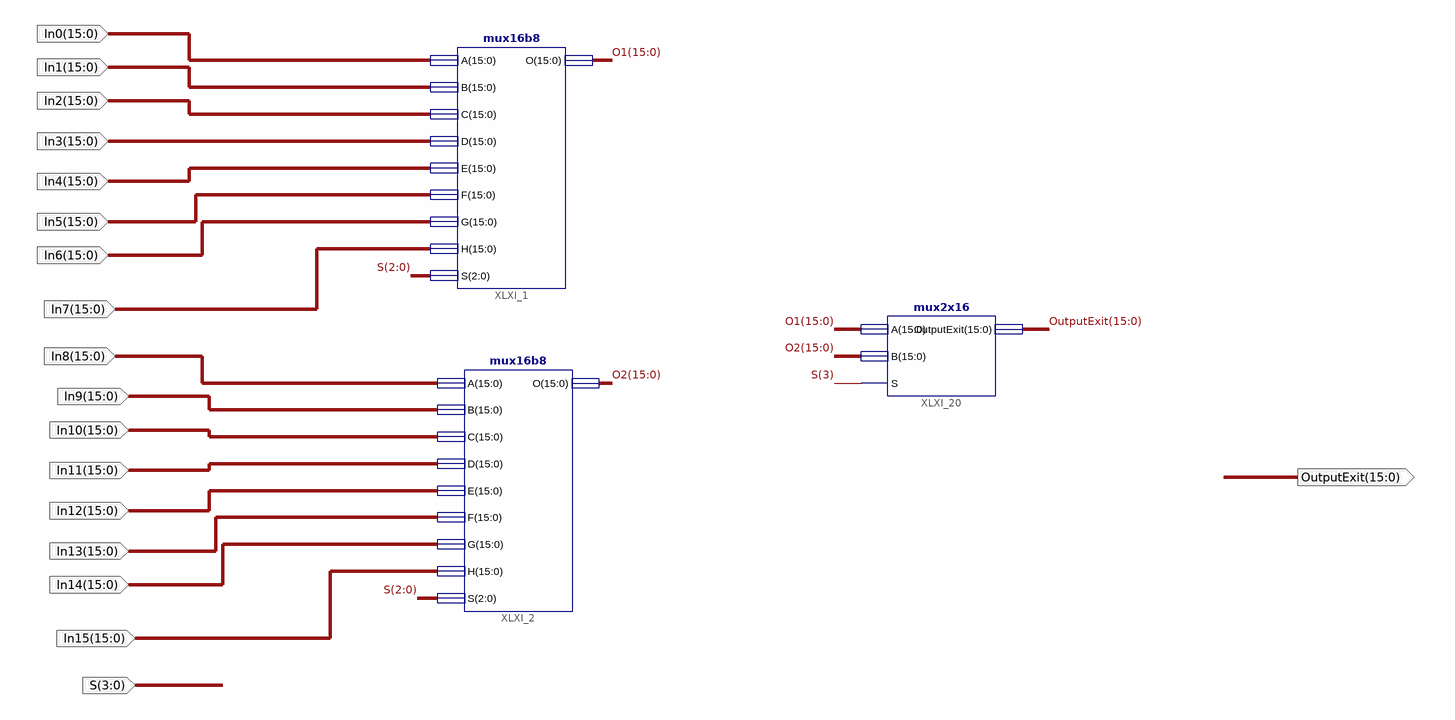
[diagram p0: schematic sheet 1]
// Xilinx ISE schematic Mux16x16.sch (spartan3e) as structural Verilog: 3 symbols, 18 ports
module Mux16x16 (
  input  [15:0] In1,
  input  [15:0] In2,
  input  [15:0] In3,
  input  [15:0] In4,
  input  [15:0] In5,
  input  [15:0] In6,
  input  [15:0] In7,
  input  [15:0] In8,
  input  [15:0] In9,
  input  [15:0] In10,
  input  [15:0] In11,
  input  [15:0] In12,
  input  [15:0] In13,
  input  [15:0] In14,
  input  [15:0] In15,
  input  [3:0] S,
  input  [15:0] In0,
  output [15:0] OutputExit
);

  wire [15:0] O1, O2;

  mux16b8 XLXI_1 (.A(In0), .B(In1), .C(In2), .D(In3), .E(In4), .F(In5), .G(In6), .H(In7), .S(S[2:0]), .O(O1));
  mux16b8 XLXI_2 (.A(In8), .B(In9), .C(In10), .D(In11), .E(In12), .F(In13), .G(In14), .H(In15), .S(S[2:0]), .O(O2));
  mux2x16 XLXI_20 (.A(O1), .B(O2), .S(S[3]), .OutputExit(OutputExit));
endmodule
